# EAGLE design receiver - Copy (EAGLE 6.5.0)
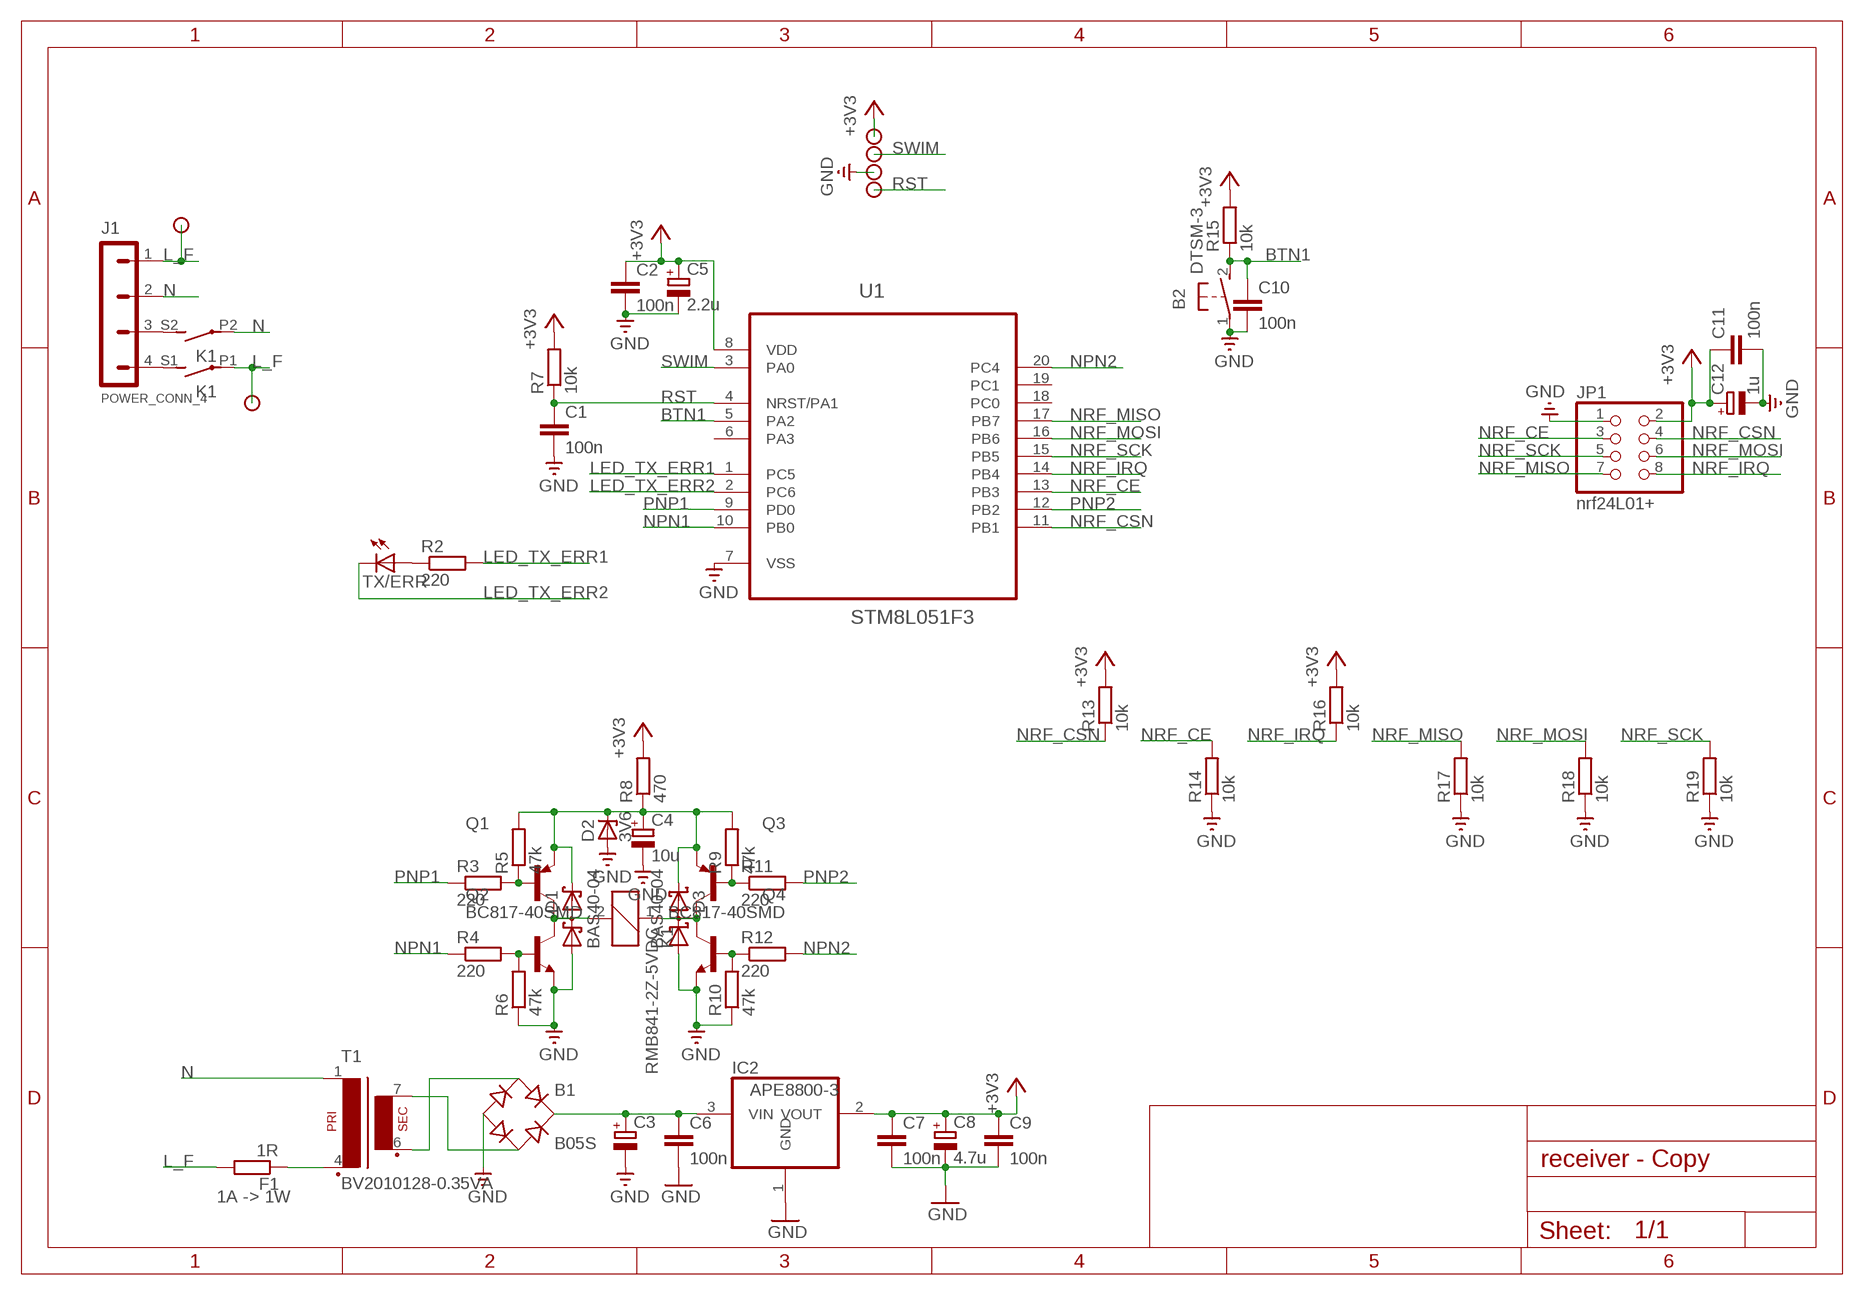
[diagram p0: schematic, sheet 1]

## Parts
B1  B05S  [MBS]
B2  DTSM-3  [DTSM-3]
C1  100n  C-EUC0603K  [C0603K]
C2  100n  C-EUC0603K  [C0603K]
C3  CPOL-EUSMCB  [SMC_B]
C4  10u  CPOL-EUSMCB  [SMC_B]
C5  2.2u  CPOL-EUSMCA  [SMC_A]
C6  100n  C-EUC0603K  [C0603K]
C7  100n  C-EUC0603K  [C0603K]
C8  4.7u  CPOL-EUSMCA  [SMC_A]
C9  100n  C-EUC0603K  [C0603K]
C10  100n  C-EUC0603K  [C0603K]
C11  100n  C-EUC0603K  [C0603K]
C12  1u  CPOL-EUSMCA  [SMC_A]
D1  BAS40-04  [SOT23]
D2  3V6  ZENER-DIODESOT23  [SOT23]
D3  BAS40-04  [SOT23]
F1  1R  R-EU_0207/10  [0207/10]
IC2  APE8800-3  [SOT23]
J1  POWER_CONN_4  [TERMINAL_BLOCK_4]
J2  CON_PAD_THICK_WIRE  [SMD_PAD_THICK_WIRE]
J3  CON_PAD_THICK_WIRE  [SMD_PAD_THICK_WIRE]
JP1  nrf24L01+  PINHD-2X4  [2X04]
K1  RMB841-2Z-5VDC  [RMB841-2Z-5VDC]
Q1  BC807-40-PNP-SOT23-BEC  [SOT23-BEC]
Q2  BC817-40SMD  [SOT23-BEC]
Q3  BC807-40-PNP-SOT23-BEC  [SOT23-BEC]
Q4  BC817-40SMD  [SOT23-BEC]
R2  220  R-EU_R0603  [R0603]
R3  220  R-EU_R0603  [R0603]
R4  220  R-EU_R0603  [R0603]
R5  47k  R-EU_R0603  [R0603]
R6  47k  R-EU_R0603  [R0603]
R7  10k  R-EU_R0603  [R0603]
R8  470  R-EU_R0603  [R0603]
R9  47k  R-EU_R0603  [R0603]
R10  47k  R-EU_R0603  [R0603]
R11  220  R-EU_R0603  [R0603]
R12  220  R-EU_R0603  [R0603]
R13  10k  R-EU_R0603  [R0603]
R14  10k  R-EU_R0603  [R0603]
R15  10k  R-EU_R0603  [R0603]
R16  10k  R-EU_R0603  [R0603]
R17  10k  R-EU_R0603  [R0603]
R18  10k  R-EU_R0603  [R0603]
R19  10k  R-EU_R0603  [R0603]
SIG_+3V1  CON_PAD  [SMD_PAD]
SIG_GND  CON_PAD  [SMD_PAD]
SIG_RST  CON_PAD  [SMD_PAD]
SIG_SWIM  CON_PAD  [SMD_PAD]
T1  BV2010128-0.35VA  [BV2010128-0.35VA]
TX/ERR  LED3MM  [LED3MM]
U1  STM8L051F3  [TSSOP20]

## Nets
+3V3: C2.1 C5.+ C7.1 C8.+ C9.1 C11.1 C12.+ IC2.2(VOUT) JP1.2 R7.2 R8.2 R13.2 R15.2 R16.2 SIG_+3V1.P$1 U1.8(VDD)
BTN1: B2.2 C10.1 R15.1 U1.5(PA2)
GND: B1.- B2.1 C1.2 C2.2 C3.- C4.- C5.- C6.2 C7.2 C8.- C9.2 C10.2 C11.2 C12.- D1.1(A1) D2.1(A) D3.1(A1) IC2.1(GND) JP1.1 Q2.E Q4.E R6.1 R10.1 R14.1 R17.1 R18.1 R19.1 SIG_GND.P$1 U1.7(VSS)
L_F: F1.2 J1.1 J2.P$1 J3.P$1 K1.P1(P)
LED_TX_ERR1: R2.2 U1.1(PC5)
LED_TX_ERR2: TX/ERR.K(C) U1.2(PC6)
N: J1.2 K1.P2(P) T1.1
N$2: R2.1 TX/ERR.A
N$3: B1.AC2 T1.7(S4)
N$4: B1.+ C3.+ C6.1 IC2.3(VIN)
N$8: B1.AC1 T1.6(S3)
N$9: Q2.B R4.2 R6.2
N$10: D1.3(C1A2) K1.2 Q1.C Q2.C
N$11: Q4.B R10.2 R12.1
N$12: Q1.B R3.2 R5.1
N$14: Q3.B R9.1 R11.1
N$15: J1.4 K1.S1(S)
N$16: J1.3 K1.S2(S)
N$17: D3.3(C1A2) K1.1 Q3.C Q4.C
N$18: C4.+ D1.2(C2) D2.3(C) D3.2(C2) Q1.E Q3.E R5.2 R8.1 R9.2
N$19: F1.1 T1.4(P2)
NPN1: R4.1 U1.10(PB0)
NPN2: R12.2 U1.20(PC4)
NRF_CE: JP1.3 R14.2 U1.13(PB3)
NRF_CSN: JP1.4 R13.1 U1.11(PB1)
NRF_IRQ: JP1.8 R16.1 U1.14(PB4)
NRF_MISO: JP1.7 R17.2 U1.17(PB7)
NRF_MOSI: JP1.6 R18.2 U1.16(PB6)
NRF_SCK: JP1.5 R19.2 U1.15(PB5)
PNP1: R3.1 U1.9(PD0)
PNP2: R11.2 U1.12(PB2)
RST: C1.1 R7.1 SIG_RST.P$1 U1.4(NRST/PA1)
SWIM: SIG_SWIM.P$1 U1.3(PA0)
Unconnected: U1.6(PA3) U1.18(PC0) U1.19(PC1)

## Notes on the sheet
- 1A -> 1W

## Library data of the parts
B1 = rectifier:B*S: Surface Mount Glass Passivated Bridge Rectifiers Source: Comchip Bridge Rectifiers B05S-G_B10S-G.pdf
B2 = switch-tact:DTSM-3
C1 C2 C6 C7 C9-C11 = resistor:C-EU: CAPACITOR, European symbol
C3-C5 C8 C12 = resistor:CPOL-EU: POLARIZED CAPACITOR, European symbol
D1 D3 = diode:BAS40-04: Silicon Schottky Diodes General-purpose diode for high-speed switching
D2 = diode:ZENER-DIODE: Z-Diode
F1 R2-R19 = resistor:R-EU_: RESISTOR, European symbol
IC2 = componente_RFSwitch:APE8800-3
J1 = CarReceiver:POWER_CONN_4
J2 J3 = componente_RFSwitch:CON_PAD_THICK_WIRE
JP1 = pinhead:PINHD-2X4: PIN HEADER
K1 = componente_RFSwitch:RMB841-2Z-5VDC
Q1 Q3 = transistor:*-PNP-: PNP Transistror
Q2 Q4 = CarReceiver:BC817*: NPN Transistor
SIG_+3V1 SIG_GND SIG_RST SIG_SWIM = componente_RFSwitch:CON_PAD
T1 = componente_RFSwitch:BV2010128-0.35VA
TX/ERR = led:LED: LED OSRAM: - CHIPLED LG R971, LG N971, LY N971, LG Q971, LY Q971, LO R971, LY R971 LH N974, LH R974 LS Q976, LO Q976, LY Q976 LO Q996 - Hyper CHIPLED LW Q18S LB Q993, LB Q99A, LB R99A - SideLED LS A670, LO A670, LY A670, LG A670, LP A670 LB A673, LV A673, LT A673, LW A673 LH A674 LY A675 LS A676, LA A676, LO A676, LY A676, LW A676 LS A679, LY A679, LG A679 - Hyper Micro SIDELED® LS Y876, LA Y876, LO Y876, LY Y876 LT Y87S - SmartLED LW L88C, LW L88S LB L89C, LB L89S, LG L890 LS L89K, LO L89K, LY L89K LS L896, LA L896, LO L896, LY L896 - TOPLED LS T670, LO T670, LY T670, LG T670, LP T670 LSG T670, LSP T670, LSY T670, LOP T670, LYG T670 LG T671, LOG T671, LSG T671 LB T673, LV T673, LT T673, LW T673 LH T674 LS T676, LA T676, LO T676, LY T676, LB T676, LH T676, LSB T676, LW T676 LB T67C, LV T67C, LT T67C, LS T67K, LO T67K, LY T67K, LW E67C LS E67B, LA E67B, LO E67B, LY E67B, LB E67C, LV E67C, LT E67C LW T67C LS T679, LY T679, LG T679 LS T770, LO T770, LY T770, LG T770, LP T770 LB T773, LV T773, LT T773, LW T773 LH T774 LS E675, LA E675, LY E675, LS T675 LS T776, LA T776, LO T776, LY T776, LB T776 LHGB T686 LT T68C, LB T68C - Hyper Mini TOPLED® LB M676 - Mini TOPLED Santana® LG M470 LS M47K, LO M47K, LY M47K Source: http://www.osram.convergy.de LUXEON: - LUMILED® LXK2-PW12-R00, LXK2-PW12-S00, LXK2-PW14-U00, LXK2-PW14-V00 LXK2-PM12-R00, LXK2-PM12-S00, LXK2-PM14-U00 LXK2-PE12-Q00, LXK2-PE12-R00, LXK2-PE12-S00, LXK2-PE14-T00, LXK2-PE14-U00 LXK2-PB12-K00, LXK2-PB12-L00, LXK2-PB12-M00, LXK2-PB14-N00, LXK2-PB14-P00, LXK2-PB14-Q00 LXK2-PR12-L00, LXK2-PR12-M00, LXK2-PR14-Q00, LXK2-PR14-R00 LXK2-PD12-Q00, LXK2-PD12-R00, LXK2-PD12-S00 LXK2-PH12-R00, LXK2-PH12-S00 LXK2-PL12-P00, LXK2-PL12-Q00, LXK2-PL12-R00 Source: www.luxeon.com KINGBRIGHT: KA-3528ASYC Source: www.kingbright.com
U1 = componente_CarRF:STM8L051F3

## Board
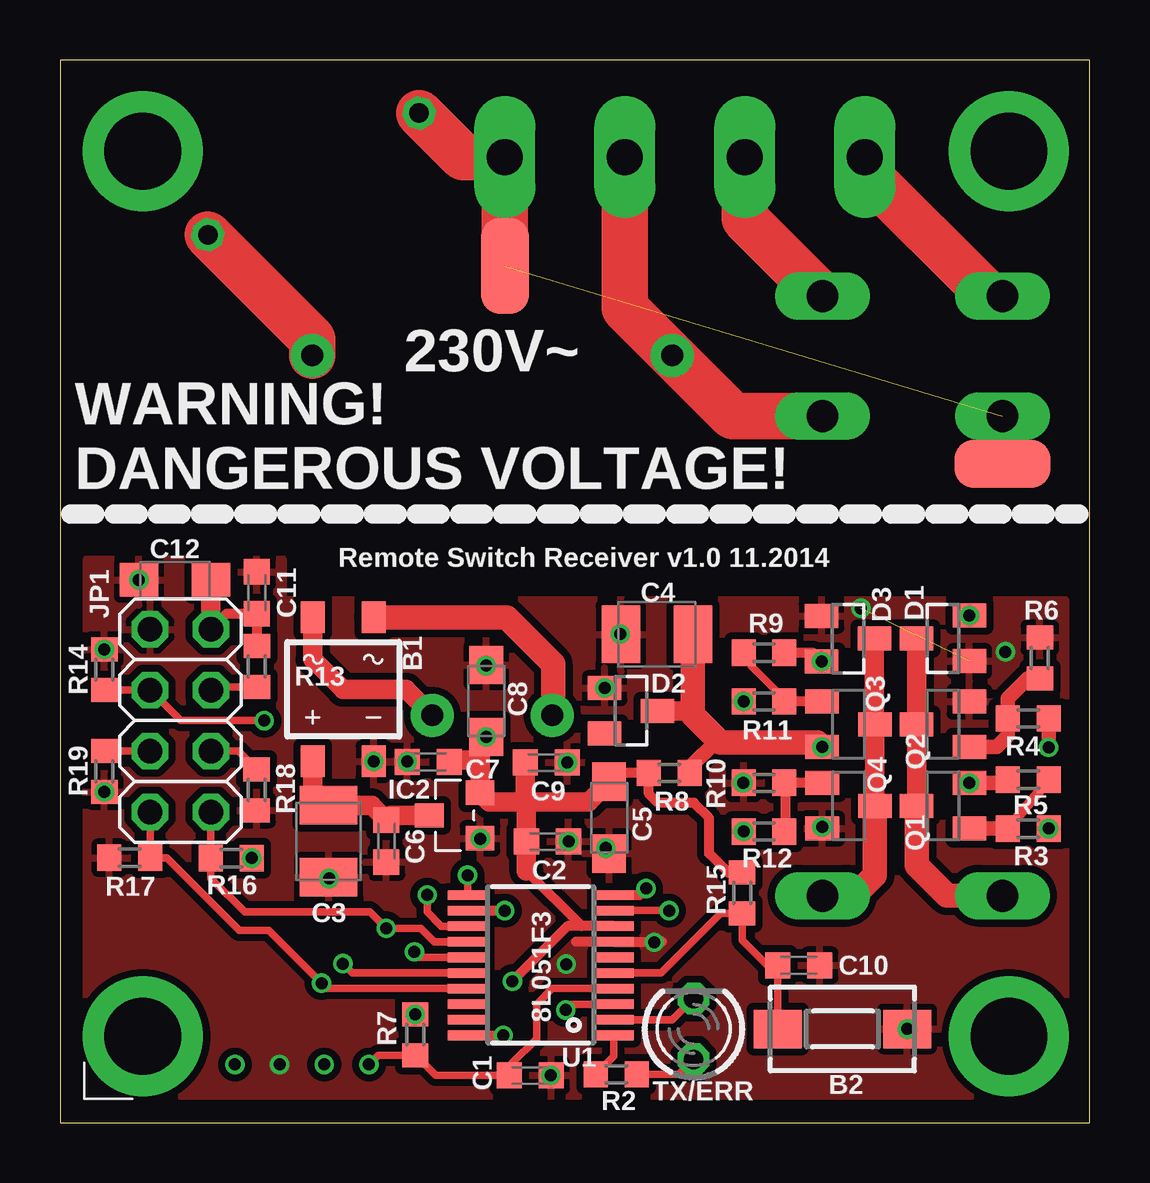
[diagram p1: board, top side]
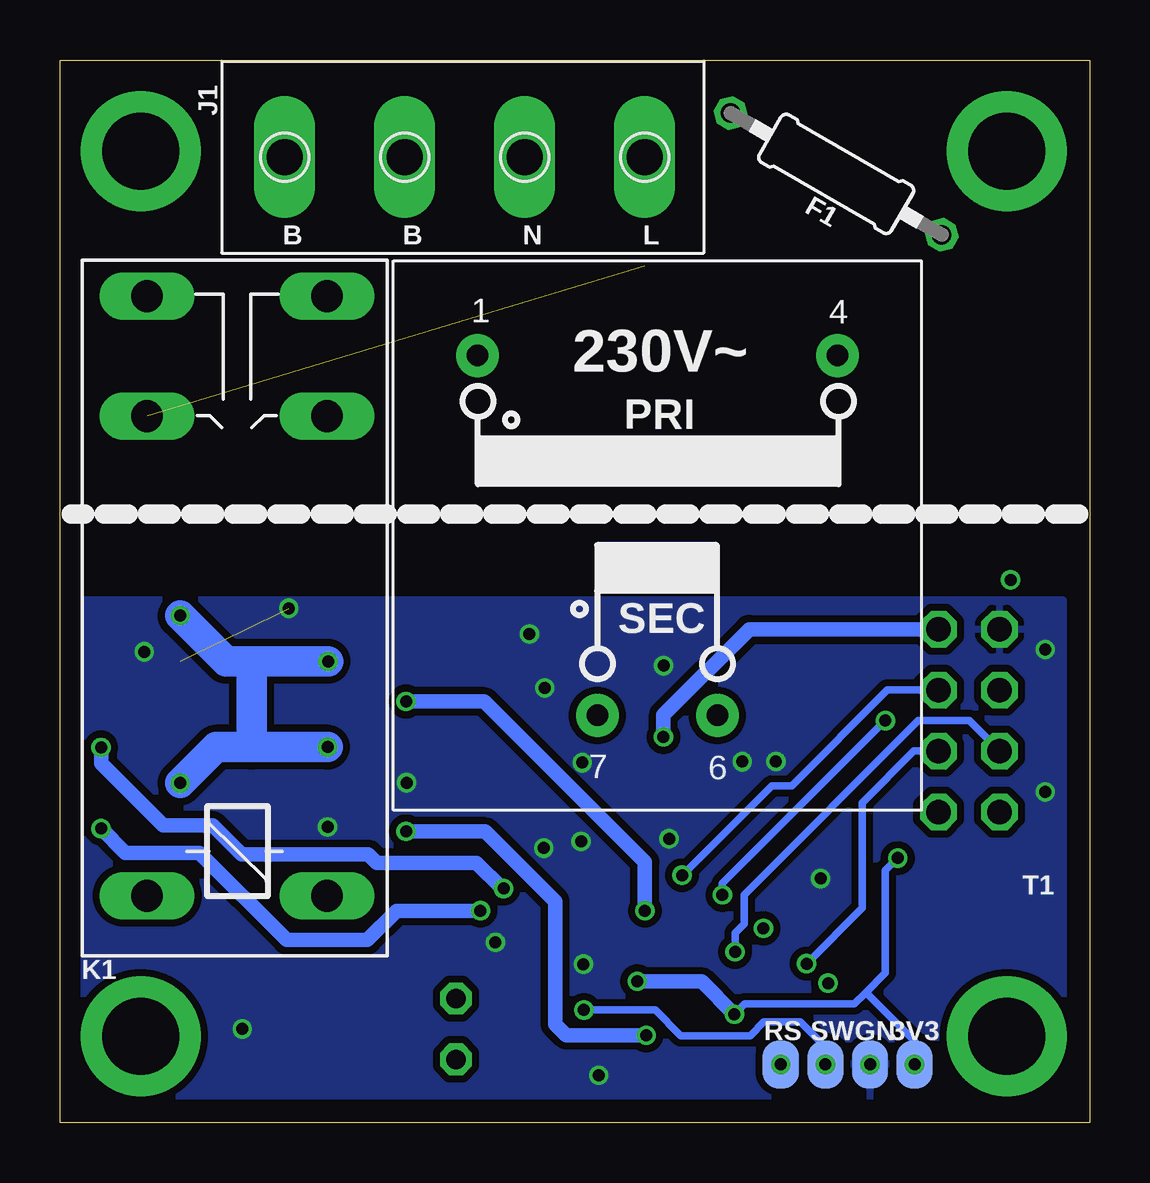
[diagram p2: board, bottom side, seen from below]

Size 42.9 x 44.3 mm. Coordinates in mm from the lower left corner, seen from the top.
Outline: 42.9,44.3 0,44.3 0,0 42.9,0 42.9,44.3
Copper layers (1*16): Top 0.035mm / dielectric 1.5mm / Bottom 0.035mm
Design rules "SeeedStudio_2layer_DRU_no_angle_20140221": minimum track width 6mil, minimum drill 12mil, track to track 6mil, track to pad 6mil, pad to pad 6mil, via to via 6mil, smd to smd 0mil, copper to edge 10mil, drill to drill 10mil, minimum pad ring 10mil, minimum via ring 6mil, stop-mask expansion 2mil, vias tented up to drill 100mil, thermal gap 10mil

### Footprints (pad centres in the part's own frame; a part is rotated, then mirrored left to right if it is on the bottom)
MBS = smd 1 x 1.3: + -1.27,-3; - 1.27,-3; AC1 -1.27,3; AC2 1.27,3
DTSM-3 = smd 2 x 1.6: 1 -2.7,0; 2 2.7,0
C0603K = smd 1.05 x 1.08: 1 -0.875,0; 2 0.875,0
SMC_B = smd 1.6 x 2.4: + -1.5,0; - 1.5,0
SMC_A = smd 1.6 x 1.4: + -1.5,0; - 1.5,0
SOT23 = smd 1 x 1.4: 1 -0.95,-1.1; 2 0.95,-1.1; 3 0,1.1
0207/10 = drill 0.813 octagon: 1 -5.08,0; 2 5.08,0
SOT23' = smd 1.016 x 1.2: 1 -0.95,-1.06; 2 0.95,-1.06; 3 0,1.06
TERMINAL_BLOCK_4 = drill 1.5 pad 2.54 long: 1 0,7.58; 2 0,2.58; 3 0,-2.42; 4 0,-7.42
SMD_PAD_THICK_WIRE = smd 4 x 2: P$1 0,0
2X04 = drill 1.016 octagon: 1 -3.81,-1.27; 2 -3.81,1.27; 3 -1.27,-1.27; 4 -1.27,1.27; 5 1.27,-1.27; 6 1.27,1.27; 7 3.81,-1.27; 8 3.81,1.27
RMB841-2Z-5VDC = drill 1.321 long: 1 -12,-3.85; 2 -12,3.65; P1 8,3.65; P2 8,-3.85; S1 13,3.65; S2 13,-3.85
SOT23-BEC = smd 1 x 1.4: B -0.95,-1.1; C 0,1.1; E 0.95,-1.1
R0603 = smd 1 x 1.1: 1 -0.85,0; 2 0.85,0
SMD_PAD = smd 2 x 1.5: P$1 0,0
BV2010128-0.35VA = drill 0.9 pad 1.778: 1 -7.5,7.5; 4 7.5,7.5; 6 2.5,-7.5; 7 -2.5,-7.5
LED3MM = drill 0.813 octagon: A -1.27,0; K 1.27,0
TSSOP20 = smd 0.4 x 1.65: 1 -3.575,-3.05; 2 -2.925,-3.05; 3 -2.275,-3.05; 4 -1.625,-3.05; 5 -0.975,-3.05; 6 -0.325,-3.05; 7 0.325,-3.05; 8 0.975,-3.05; 9 1.625,-3.05; 10 2.275,-3.05; 11 2.275,3.05; 12 1.625,3.05; 13 0.975,3.05; 14 0.325,3.05; 15 -0.325,3.05; 16 -0.975,3.05; 17 -1.625,3.05; 18 -2.275,3.05; 19 -2.925,3.05; 20 -3.575,3.05

### Placement (x,y rotation side)
B1  11.8,18.07 0 top
B2  32.6,3.91 180 top
C1  19.59,1.97 0 top
C2  20.31,11.72 0 top
C3  11.19,11.73 270 top
C4  24.87,20.36 180 top
C5  22.88,12.72 270 top
C6  13.6,11.74 270 top
C7  15.34,15.04 180 top
C8  17.76,17.58 90 top
C9  20.26,15.01 0 top
C10  30.78,6.56 0 top
C11  8.2,22.09 90 top
C12  4.79,22.63 180 top
D1  36.79,20.19 90 top
D2  23.79,17.17 270 top
D3  32.83,20.18 270 top
F1  10.56,39.55 150 bottom
IC2  APE8800-3  [SOT23']  16.44,12.81 90 top
J1  26.12,40.25 270 bottom
J2  18.54,35.71 90 top
J3  39.27,27.46 0 top
JP1  5.02,16.76 270 top
K1  35.62,21.46 90 bottom
Q1  36.79,13.21 90 top
Q2  36.79,16.61 90 top
Q3  32.85,16.61 270 top
Q4  32.86,13.21 270 top
R2  23.18,2.02 180 top
R3  40.34,12.26 180 top
R4  40.34,16.85 180 top
R5  40.34,14.3 180 top
R6  40.83,19.37 270 top
R7  14.8,3.67 90 top
R8  25.39,14.58 180 top
R9  29.33,19.59 0 top
R10  29.33,14.17 0 top
R11  29.33,17.56 180 top
R12  29.33,12.14 180 top
R13  8.2,19.02 90 top
R14  1.85,18.88 270 top
R15  28.42,9.58 90 top
R16  7.14,11.03 0 top
R17  2.91,11.05 0 top
R18  8.19,13.87 90 top
R19  1.85,14.64 90 top
SIG_+3V1  7.29,2.43 270 bottom
SIG_GND  9.15,2.43 90 bottom
SIG_RST  12.87,2.43 270 bottom
SIG_SWIM  11.01,2.43 270 bottom
T1  18.01,24.48 0 bottom
TX/ERR  26.4,3.91 90 top
U1  20.03,7.22 90 top

### Tracks (layer width: path | path; a pad name or v marks a point on that pad's centre or on a via)
+3V3  (via drill 0.5)
  Top 0.406: R13.2 C11.1 6.93,21.21 JP1.2 | 21.73,8.2 19.43,10.49 | C5.+ 23.24,14.58 R8.2 24.54,13.71 24.91,13.34 26.41,13.34 27.05,12.7 27.05,11.22 27.84,10.43 R15.2 | 21.73,8.2 21.16,8.2 v18.85,5.89 | U1.8 arc90 U1.8 21.73,8.2
  Top 0.813: 19.43,10.49 C2.1 19.43,13.28 19.33,13.38 | C8.+ 17.5,15.82 17.5,15.13 | 17.5,15.13 IC2.2 17.88,13.38 19.33,13.38 | C7.1 16.3,15.13 17.5,15.13 | C5.+ 22.04,13.38 19.33,13.38 | C9.1 19.39,13.44 19.33,13.38 | C12.+ JP1.2
  Bottom 0.305: R16.2 8.51,10.51 8.51,6.24 9.36,5.39 | SIG_+3V1.P$1 7.29,3.39 9.29,5.39 9.36,5.39 | R7.2 14.37,4.95 9.8,4.95 9.36,5.39
  Bottom 0.61: C8.+ 17.76,17 14.19,20.57 JP1.2 | v18.85,5.89 16.17,5.89 R7.2
  other vias: 7.29,2.43 17.76,16.08 14.8,4.52 7.99,11.03
BTN1
  Top 0.305: U1.5 25.06,6.25 27.53,8.72 R15.1 28.42,7.6 29.46,6.56 C10.1 B2.2
GND  (via drill 0.5)  (1 unrouted)
  Top 0.305: C2.2 v21.18,11.73
  Top 0.406: 21.49,7.54 U1.7 25.08,7.54
  other vias: 21.09,6.61 23.34,20.37 39.39,19.63 33.37,21.44 31.75,12.33 28.46,14.17 22.7,18.12 24.76,7.52 9.15,2.43 35.31,3.91 13.07,15.06 17.52,11.84 17.75,19.05 14.47,15.05 11.21,10.18 20.45,1.98 3.29,22.63 21.14,15.01 22.74,11.45 1.85,19.73 1.85,13.79
  pour Top (isolate 0.3): 1.1,23.5 9.3,23.5 9.3,21.8 41.9,21.8 41.9,1.1 1.1,1.1
  pour Bottom (isolate 0.3): 1.1,1.1 41.9,1.1 41.9,21.8 1.1,21.8
L_F  (1 unrouted)
  Top 1.778: J3.P$1 | J3.P$1 K1.P1
  Top 1.93: J2.P$1 J1.1 16.8,40.25 F1.2
LED_TX_ERR1
  Top 0.305: U1.1 23.08,2.77 R2.2
LED_TX_ERR2
  Top 0.305: U1.2 25.52,4.29 TX/ERR.K
N
  Top 1.93: J1.2 23.54,33.95 T1.1 28.03,29.46 K1.P2
N$2
  Top 0.305: R2.1 25.78,2.02 TX/ERR.A
N$3
  Top 1.016: B1.AC2 18.61,21.07 20.55,19.13 20.55,17.02 T1.7
N$4
  Top 0.813: B1.+ 10.53,13.89 C3.+ 12.98,13.23 C6.1 13.79,12.81 IC2.3
N$5  (via drill 3.2 pad 5)
  other vias: 39.54,40.5
N$6  (via drill 3.2 pad 5)
  other vias: 3.45,3.6
N$7  (via drill 3.2 pad 5)
  other vias: 39.54,3.6
N$8
  Top 0.813: B1.AC1 10.53,19.33 11.8,18.06 14.43,18.06 T1.6
N$9
  Top 0.61: Q2.B 39.03,15.66 39.49,16.12 R4.2 39.49,17.68 40.33,18.52 R6.2
N$10
  Top 0.813: Q1.C Q2.C D1.3
  Top 1.016: Q1.C 35.69,10.73 36.95,9.47 K1.2
N$11
  Top 0.406: Q4.B 30.21,14.16 | 30.21,14.16 R10.2 | 30.21,14.16 30.21,12.17 R12.1
N$12
  Top 0.406: R5.1 R3.2
  Top 0.61: Q1.B R3.2
N$13  (via drill 3.2 pad 5)
  other vias: 3.45,40.5
N$14
  Top 0.305: R11.1 30.18,17.67 28.81,19.04 28.81,19.26 R9.1
  Top 0.406: Q3.B R11.1
N$15
  Top 1.93: J1.4 33.54,39.64 38.71,34.47 K1.S1
N$16
  Top 1.93: J1.3 28.54,37.69 K1.S2
N$17
  Top 0.406: Q4.C
  Top 0.813: Q4.C Q3.C 33.93,16.63 D3.3
  Top 1.016: Q4.C 33.95,10.31 33.11,9.47 K1.1
N$18  (via drill 0.5)
  Top 0.406: 39.35,14.16 R5.2 | D3.2 31.37,19.59 R9.2
  Top 0.61: Q1.E 39.35,14.16 | R8.1 26.24,14.8 27.4,15.96
  Top 0.813: D2.3 26.36,17.17 26.37,17.18
  Top 1.016: C4.+ 26.37,17.18 26.37,16.99 27.4,15.96 27.5,15.86 31.55,15.86 Q3.E
  Bottom 1.27: D3.2 34.91,19.23 | 34.91,19.23 35.98,19.23 D1.2 | Q3.E 34.92,15.66 | 34.92,15.66 36.39,15.66 Q1.E | 34.92,15.66 34.92,19.22 34.91,19.23
  other vias: 31.75,15.66 31.73,19.23 37.89,21.14 37.89,14.16
N$19
  Top 1.93: F1.1 10.51,32.66 T1.4
NPN1  (via drill 0.5)
  Top 0.305: U1.10
  Top 0.406: U1.10 24.16,9.49 v24.42,9.76
  Top 0.61: R4.1 v41.19,15.64
  Bottom 0.61: v24.42,9.76 24.48,9.76 25.56,10.84 29.7,10.84 30.05,11.19 35.33,11.19 36.53,12.39 38.6,12.39 41.19,14.98 v41.19,15.64
NPN2  (via drill 0.5)
  Top 0.406: U1.20 v18.47,3.65
  Bottom 0.61: v18.47,3.65 21.8,3.65 22.27,4.11 22.27,9.23 25.18,12.14 R12.2
  other vias: 28.48,12.14
NRF_CE  (via drill 0.5)
  Top 0.305: U1.13 15.89,8.19 15.3,8.78 v15.3,9.5 | v8.51,16.76 5.03,16.76 JP1.3 R14.2
  Bottom 0.305: v15.3,9.5 15.3,9.97 v8.51,16.76
NRF_CSN  (via drill 0.5)
  Top 0.305: U1.11 v16.98,10.32 | JP1.4 6.43,18.17 R13.1
  Bottom 0.305: v16.98,10.32 13.25,14.05 12.42,14.05 8.44,18.03 JP1.4
NRF_IRQ  (via drill 0.5)
  Top 0.305: JP1.8 R16.1 6.29,10.19 7.7,8.78 12.91,8.78 v13.59,8.1 15.04,8.1 15.6,7.54 U1.14
NRF_MISO  (via drill 0.5)
  Top 0.305: U1.17 11.12,5.59 v10.9,5.82 8.7,8.02 7.47,8.02 4.44,11.05 R17.2 JP1.7
NRF_MOSI  (via drill 0.5)
  Top 0.305: U1.16 12.18,6.25 v11.79,6.63 | JP1.6 7.42,15.49 R18.2
  Bottom 0.305: v11.79,6.63 9.47,8.95 9.47,13.34 7.32,15.49 JP1.6
NRF_SCK  (via drill 0.5)
  Top 0.305: U1.15 | U1.15 | U1.15 14.99,6.89 v14.77,7.12 | R19.2 JP1.5
  Bottom 0.305: JP1.5 5.02,16.76 7.13,16.76 14.39,9.5 14.39,8.3 14.77,7.92 v14.77,7.12
PNP1  (via drill 0.5)
  Top 0.305: U1.9 arc90 U1.9 v25.38,8.85 v25.38,8.84
  Bottom 0.61: v25.38,8.84 28.87,8.84 30.09,7.62 33.46,7.62 37.09,11.25 40.18,11.25 R3.1
  other vias: 41.19,12.26
PNP2  (via drill 0.5)
  Top 0.305: v18.52,8.85 v18.53,8.84
  Top 0.406: U1.12 v18.52,8.85
  Bottom 0.61: v18.53,8.84 18.53,10.87 25.22,17.56 R11.2
  other vias: 28.48,17.56
RST  (via drill 0.5)
  Top 0.305: U1.4 20.52,5.59 19.86,4.94 19.86,3.5 18.83,2.47 18.83,2.08 C1.1 15.65,1.97 R7.1 13.26,2.82 SIG_RST.P$1
  other vias: 12.87,2.43
SWIM  (via drill 0.5)
  Top 0.305: U1.3 21.32,4.95 v21.07,4.7
  Bottom 0.305: v21.07,4.7 18.1,4.7 17.03,3.63 14.15,3.63 13.58,4.2 12.05,4.2 11.01,3.16 SIG_SWIM.P$1 11.01,2.79
  other vias: 11.01,2.43

### Text on the board
tPlace: 230V~ | WARNING! | DANGEROUS VOLTAGE! | Remote Switch Receiver v1.0 11.2014 | 8L051F3
bPlace: L | N | B | B | 230V~ | 3V3 | GN | SW | RS